# EasyEDA Pro project ProPrj_stm32线束检测系统_2025-05-23.epro, schematic Schematic1_1
Board Name: Board1_1; Create Date: 2025-05-20; Page Name: P1; Project Name: stm32线束检测系统; Schematic Name: Schematic1_1; Update Date: 2025-05-23; Company: 嘉立创EDA; Page Size: A4; Version: V1.0
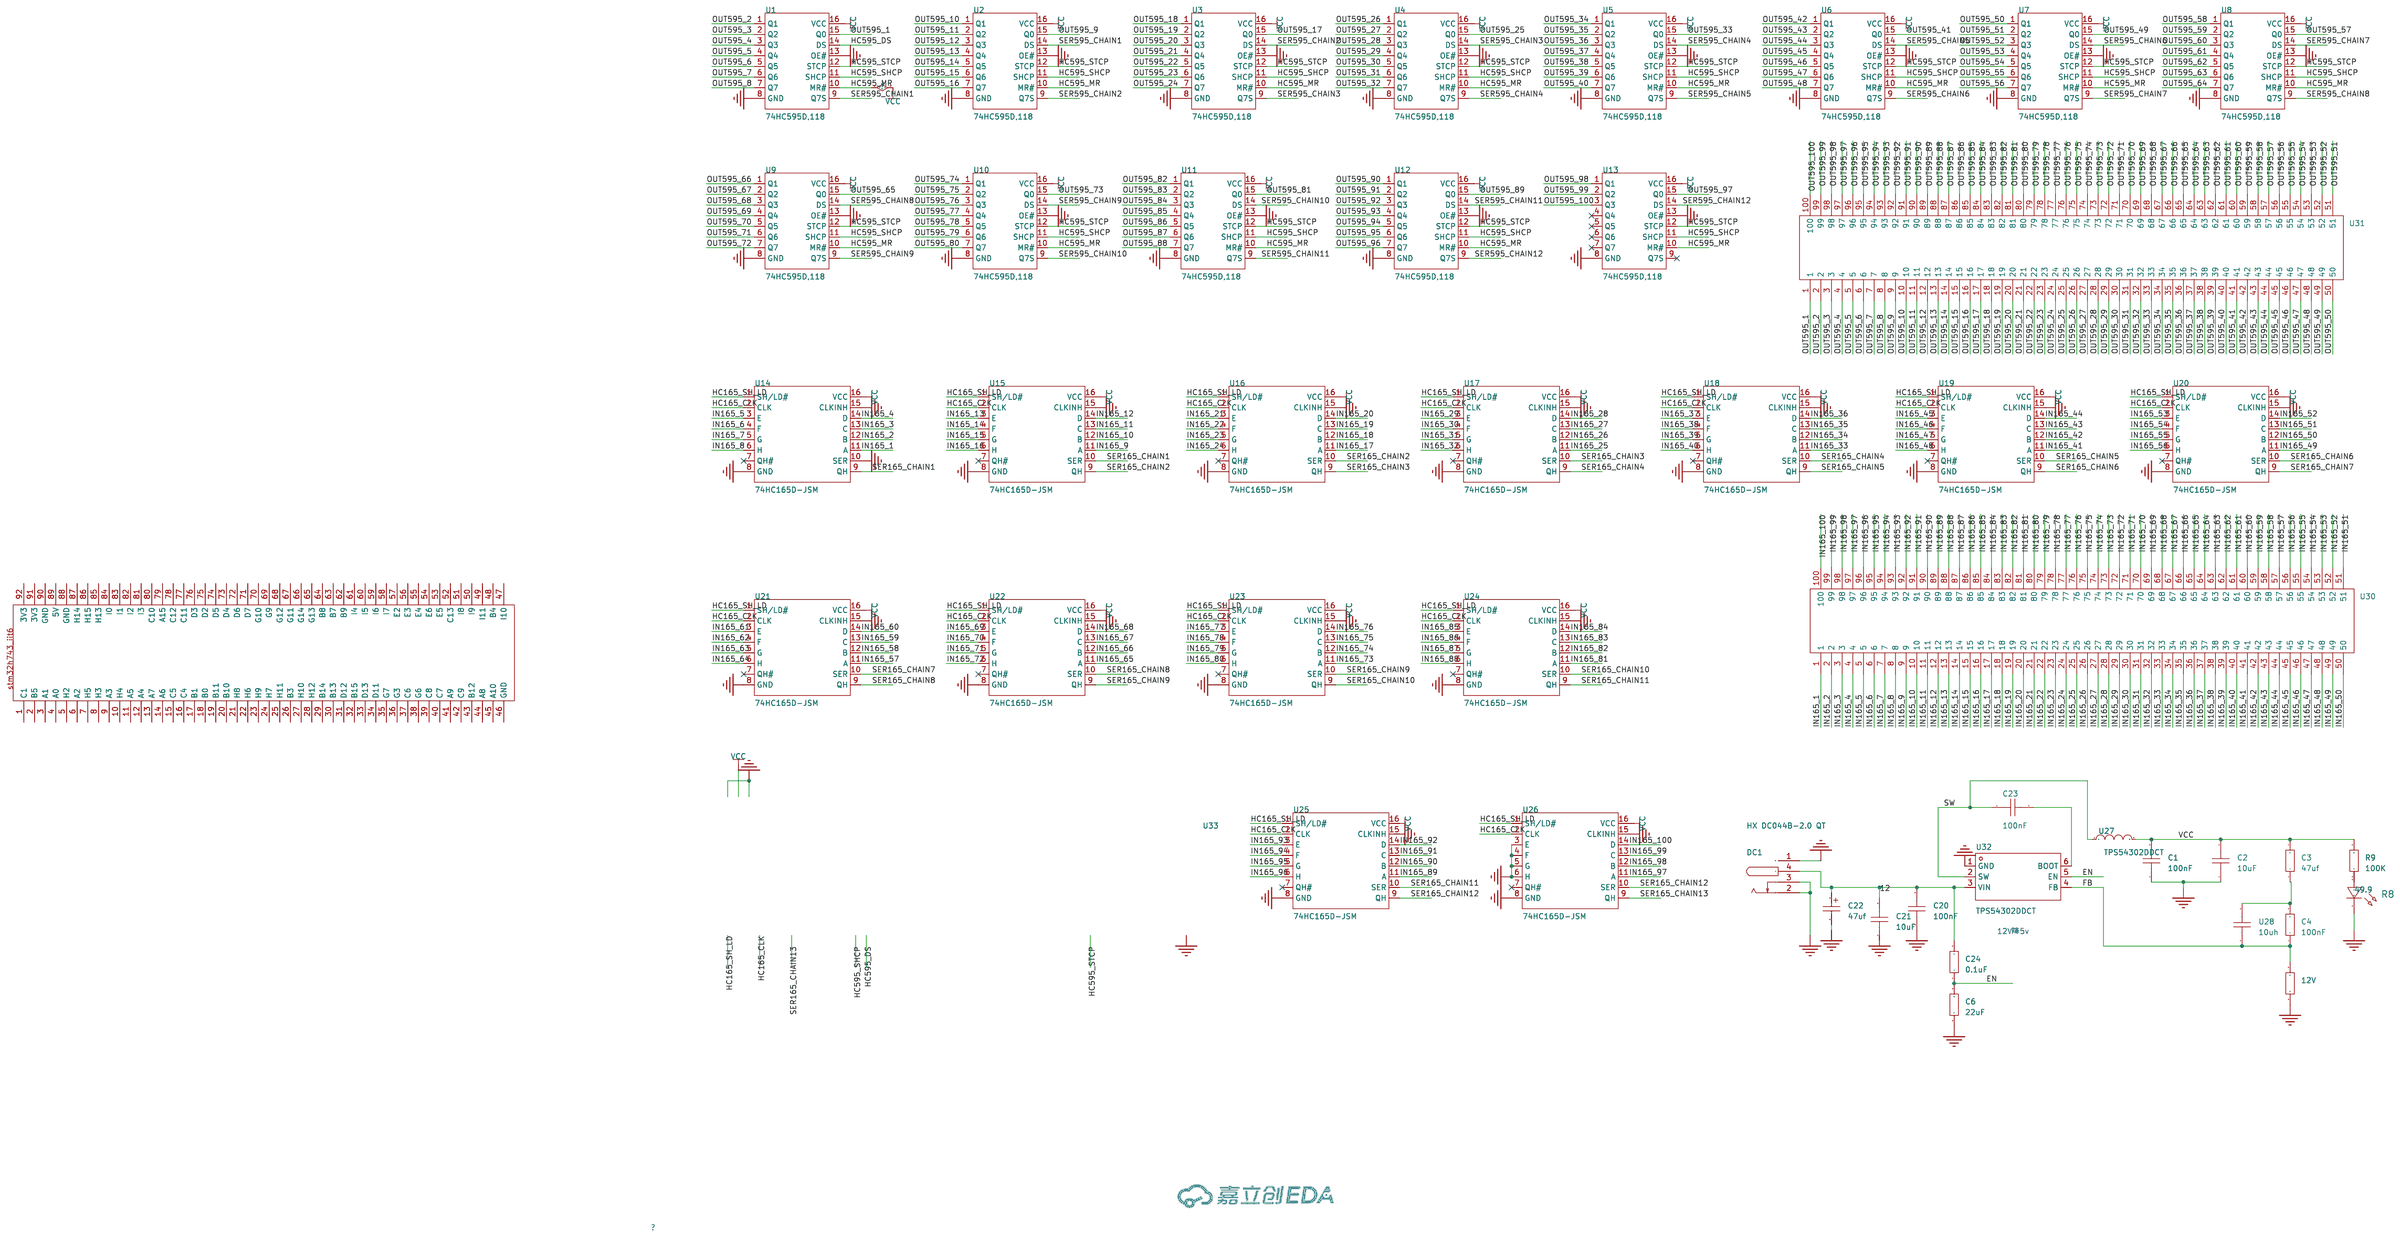
[diagram p0: schematic sheet]

## Parts
12V  HX DC044B-2.0 QT  [DC-IN-TH_HX-DC044B-2.0-QT]
C1  100nF  [C0805]
C2  10uF  [C0805]
C3  47uf  [C_Ele_SMD_5x5.4mm]
C4  100nF  [C0805]
C6  22uF  [C0603]
C20  100nF  [C0805]
C21  10uF  [C0805]
C22  47uf  [C_Ele_SMD_5x5.4mm]
C23  100nF  [C0805]
C24  0.1uF  [C0603]
DC1  HX DC044B-2.0 QT  [DC-IN-TH_HX-DC044B-2.0-QT]
R8  49.9  [R0805]
R9  100K  [R0805]
U1  74HC595D,118  [SOIC-16_L9.9-W3.9-P1.27-LS6.0-BL]
U2  74HC595D,118  [SOIC-16_L9.9-W3.9-P1.27-LS6.0-BL]
U3  74HC595D,118  [SOIC-16_L9.9-W3.9-P1.27-LS6.0-BL]
U4  74HC595D,118  [SOIC-16_L9.9-W3.9-P1.27-LS6.0-BL]
U5  74HC595D,118  [SOIC-16_L9.9-W3.9-P1.27-LS6.0-BL]
U6  74HC595D,118  [SOIC-16_L9.9-W3.9-P1.27-LS6.0-BL]
U7  74HC595D,118  [SOIC-16_L9.9-W3.9-P1.27-LS6.0-BL]
U8  74HC595D,118  [SOIC-16_L9.9-W3.9-P1.27-LS6.0-BL]
U9  74HC595D,118  [SOIC-16_L9.9-W3.9-P1.27-LS6.0-BL]
U10  74HC595D,118  [SOIC-16_L9.9-W3.9-P1.27-LS6.0-BL]
U11  74HC595D,118  [SOIC-16_L9.9-W3.9-P1.27-LS6.0-BL]
U12  74HC595D,118  [SOIC-16_L9.9-W3.9-P1.27-LS6.0-BL]
U13  74HC595D,118  [SOIC-16_L9.9-W3.9-P1.27-LS6.0-BL]
U14  74HC165D-JSM  [SOP-16_L10.0-W3.9-P1.27-LS6.0-BL]
U15  74HC165D-JSM  [SOP-16_L10.0-W3.9-P1.27-LS6.0-BL]
U16  74HC165D-JSM  [SOP-16_L10.0-W3.9-P1.27-LS6.0-BL]
U17  74HC165D-JSM  [SOP-16_L10.0-W3.9-P1.27-LS6.0-BL]
U18  74HC165D-JSM  [SOP-16_L10.0-W3.9-P1.27-LS6.0-BL]
U19  74HC165D-JSM  [SOP-16_L10.0-W3.9-P1.27-LS6.0-BL]
U20  74HC165D-JSM  [SOP-16_L10.0-W3.9-P1.27-LS6.0-BL]
U21  74HC165D-JSM  [SOP-16_L10.0-W3.9-P1.27-LS6.0-BL]
U22  74HC165D-JSM  [SOP-16_L10.0-W3.9-P1.27-LS6.0-BL]
U23  74HC165D-JSM  [SOP-16_L10.0-W3.9-P1.27-LS6.0-BL]
U24  74HC165D-JSM  [SOP-16_L10.0-W3.9-P1.27-LS6.0-BL]
U25  74HC165D-JSM  [SOP-16_L10.0-W3.9-P1.27-LS6.0-BL]
U26  74HC165D-JSM  [SOP-16_L10.0-W3.9-P1.27-LS6.0-BL]
U27  TPS54302DDCT  [TSOT-23-6_L2.9-W1.6-P0.95-LS2.8-BR]
U28  10uh  [IND-SMD_L4.5-W4.0_SCD0403T]
U30  -  [2x50_P2.54_TH]
U31  -  [2x50_P2.54_TH]
U32  TPS54302DDCT  [TSOT-23-6_L2.9-W1.6-P0.95-LS2.8-BR]
U33  -  [stm32h743]

## Library data of the parts
12V DC1 = HX DC044B-2.0 QT: 连接器类型:DC电源插座;安装方式:弯插;触点内径:2mm;触点外径:5.8mm;额定电压:30V;触头材质:-;触头镀层:-;工作温度范围:-;焊接温度(最大值):-;; LCSC Part Name: DC电源插座 内径:2mm 外径:5.8mm; Supplier Part: C41375962; Manufacturer: hanxia(韩下); Supplier Footprint: 插件; Datasheet: https://atta.szlcsc.com/upload/public/pdf/source/20240830/7C11609858F94C5A32999C6C6EF5F6BF.pdf; Supplier: LCSC; Connector Type: DC电源插座; Mounting Style: 弯插; Inside Contact Diameter: 2mm; Outside Contact Diameter: 5.8mm; Voltage Rating (Max): 30V
C1 C2 C20 C21 = CAP_0805: Supplier Footprint: 0805
C3 C22 = C_Ele_SMD_5x5.4mm: Supplier Footprint: SMD,5x5.4mm
C4 C23 = CAP_0805: Supplier Footprint: 0603
C6 C24 = CAP_0603: Supplier Footprint: 0603
R8 R9 = Res_0805: Supplier Footprint: 0603
U1-U13 = 74HC595D,118: 功能:串行至串行或并行;电源电压:2V~6V;元件数:1;每个元件位数:8;; LCSC Part Name: 三态输出 串行至串行或并行移位寄存器; Supplier Part: C5947; Manufacturer: Nexperia(安世); Supplier Footprint: SOIC-16; JLCPCB Part Class: 基础库; Datasheet: https://atta.szlcsc.com/upload/public/pdf/source/20240724/C3A3241CA190230F407C83CEC4244600.pdf; Supplier: LCSC; Function: 串行至串行或并行; Supply Voltage: 2V~6V; Number of Elements: 1; Number of Bits per Element: 8; Output Type: 三态; Series: 74HC; Operating Temperature: -40℃~+125℃
U14-U26 = 74HC165D-JSM: 功能:-;工作电压:2V~6V;时钟频率(fc):-;元件数:1;每个元件位数:8;; Supplier Part: C22447130; Manufacturer: JSMSEMI(杰盛微); Supplier Footprint: SOP-16; JLCPCB Part Class: 扩展库; Datasheet: https://atta.szlcsc.com/upload/public/pdf/source/20240716/3BCDED5764C4B39E28DFA970EEB44471.pdf; Supplier: LCSC; Voltage - Supply: 2V~6V; Number of Elements: 1; Number of Bits per Element: 8; Series: 74HC; Operating Temperature: -40℃~+125℃
U27 U32 = TPS54302DDCT: 功能类型:降压型;输出类型:可调;工作电压:4.5V~28V;输出电压:596mV~28V;输出电流:3A;; LCSC Part Name: 4.5V至28V输入,3A输出,低EMI同步降压转换器; Supplier Part: C129370; Manufacturer: TI(德州仪器); Supplier Footprint: TSOT-23-6; JLCPCB Part Class: 扩展库; Datasheet: https://www.ti.com/cn/lit/gpn/tps54302; Supplier: LCSC; Function: 降压型; Output Type: 可调; Input Voltage: 4.5V~28V; Output Voltage: 596mV~28V; Output Current: 3A; Switching Frequency: 400kHz; Operating Temperature: -40℃~+125℃@(TJ); Synchronous Rectification: 是; Number of Outputs: 1; Topology: 降压式; Switch tube (built-in/external): 内置
U28 = L-03/CD43_C9900011087: LCSC Part Name: L-03/CD43; Supplier Part: C9900011087; Supplier Footprint: 10uH; JLCPCB Part Class: 扩展库; Supplier: LCSC
U30 U31 = 2x50_P2.54_TH
U33 = stm32h743

## Nets
GND: 12V.1 C1.1 C2.1 C6.1 C20.1 C21.1 C22.2 DC1.1(SHELL) DC1.2 DC1.3 R8.1(C) U1.8(GND) U1.13(OE#) U2.8(GND) U2.13(OE#) U3.8(GND) U3.13(OE#) U4.8(GND) U4.13(OE#) U5.8(GND) U5.13(OE#) U6.8(GND) U6.13(OE#) U7.8(GND) U7.13(OE#) U8.8(GND) U8.13(OE#) U9.8(GND) U9.13(OE#) U10.8(GND) U10.13(OE#) U11.8(GND) U11.13(OE#) U12.8(GND) U12.13(OE#) U13.8(GND) U13.13(OE#) U14.8(GND) U14.10(SER) U14.15(CLKINH) U15.8(GND) U15.15(CLKINH) U16.8(GND) U16.15(CLKINH) U17.8(GND) U17.15(CLKINH) U18.8(GND) U18.15(CLKINH) U19.8(GND) U19.15(CLKINH) U20.8(GND) U20.15(CLKINH) U21.8(GND) U21.15(CLKINH) U22.8(GND) U22.15(CLKINH) U23.8(GND) U23.15(CLKINH) U24.8(GND) U24.15(CLKINH) U25.8(GND) U25.15(CLKINH) U26.3(E) U26.4(F) U26.5(G) U26.6(H) U26.8(GND) U26.15(CLKINH) U32.1(GND)
VCC: C1.2 C2.2 C3.2 R9.2 U1.10(MR#) U1.16(VCC) U2.10(MR#) U2.16(VCC) U3.10(MR#) U3.16(VCC) U4.10(MR#) U4.16(VCC) U5.10(MR#) U5.16(VCC) U6.10(MR#) U6.16(VCC) U7.10(MR#) U7.16(VCC) U8.10(MR#) U8.16(VCC) U9.10(MR#) U9.16(VCC) U10.10(MR#) U10.16(VCC) U11.10(MR#) U11.16(VCC) U12.10(MR#) U12.16(VCC) U13.10(MR#) U13.16(VCC) U14.16(VCC) U15.16(VCC) U16.16(VCC) U17.16(VCC) U18.16(VCC) U19.16(VCC) U20.16(VCC) U21.16(VCC) U22.16(VCC) U23.16(VCC) U24.16(VCC) U25.16(VCC) U26.16(VCC) U27.2
12: C20.2 C21.2 C22.1 C24.2 DC1.4 U32.3(VIN)
EN: C6.2 C24.1 U32.5(EN)
FB: 12V.2 C4.1 U28.1 U32.4(FB)
HC165_CLK: U14.2(CLK) U15.2(CLK) U16.2(CLK) U17.2(CLK) U18.2(CLK) U19.2(CLK) U20.2(CLK) U21.2(CLK) U22.2(CLK) U23.2(CLK) U24.2(CLK) U25.2(CLK) U26.2(CLK)
HC165_SH_LD: U14.1(SH/LD#) U15.1(SH/LD#) U16.1(SH/LD#) U17.1(SH/LD#) U18.1(SH/LD#) U19.1(SH/LD#) U20.1(SH/LD#) U21.1(SH/LD#) U22.1(SH/LD#) U23.1(SH/LD#) U24.1(SH/LD#) U25.1(SH/LD#) U26.1(SH/LD#)
HC595_DS: U1.14(DS)
HC595_SHCP: U1.11(SHCP) U2.11(SHCP) U3.11(SHCP) U4.11(SHCP) U5.11(SHCP) U6.11(SHCP) U7.11(SHCP) U8.11(SHCP) U9.11(SHCP) U10.11(SHCP) U11.11(SHCP) U12.11(SHCP) U13.11(SHCP)
HC595_STCP: U1.12(STCP) U2.12(STCP) U3.12(STCP) U4.12(STCP) U5.12(STCP) U6.12(STCP) U7.12(STCP) U8.12(STCP) U9.12(STCP) U10.12(STCP) U11.12(STCP) U12.12(STCP) U13.12(STCP)
IN165_1: U14.11(A) U30.1
IN165_2: U14.12(B) U30.2
IN165_3: U14.13(C) U30.3
IN165_4: U14.14(D) U30.4
IN165_5: U14.3(E) U30.5
IN165_6: U14.4(F) U30.6
IN165_7: U14.5(G) U30.7
IN165_8: U14.6(H) U30.8
IN165_9: U15.11(A) U30.9
IN165_10: U15.12(B) U30.10
IN165_11: U15.13(C) U30.11
IN165_12: U15.14(D) U30.12
IN165_13: U15.3(E) U30.13
IN165_14: U15.4(F) U30.14
IN165_15: U15.5(G) U30.15
IN165_16: U15.6(H) U30.16
IN165_17: U16.11(A) U30.17
IN165_18: U16.12(B) U30.18
IN165_19: U16.13(C) U30.19
IN165_20: U16.14(D) U30.20
IN165_21: U16.3(E) U30.21
IN165_22: U16.4(F) U30.22
IN165_23: U16.5(G) U30.23
IN165_24: U16.6(H) U30.24
IN165_25: U17.11(A) U30.25
IN165_26: U17.12(B) U30.26
IN165_27: U17.13(C) U30.27
IN165_28: U17.14(D) U30.28
IN165_29: U17.3(E) U30.29
IN165_30: U17.4(F) U30.30
IN165_31: U17.5(G) U30.31
IN165_32: U17.6(H) U30.32
IN165_33: U18.11(A) U30.33
IN165_34: U18.12(B) U30.34
IN165_35: U18.13(C) U30.35
IN165_36: U18.14(D) U30.36
IN165_37: U18.3(E) U30.37
IN165_38: U18.4(F) U30.38
IN165_39: U18.5(G) U30.39
IN165_40: U18.6(H) U30.40
IN165_41: U19.11(A) U30.41
IN165_42: U19.12(B) U30.42
IN165_43: U19.13(C) U30.43
IN165_44: U19.14(D) U30.44
IN165_45: U19.3(E) U30.45
IN165_46: U19.4(F) U30.46
IN165_47: U19.5(G) U30.47
IN165_48: U19.6(H) U30.48
IN165_49: U20.11(A) U30.49
IN165_50: U20.12(B) U30.50
IN165_51: U20.13(C) U30.51
IN165_52: U20.14(D) U30.52
IN165_53: U20.3(E) U30.53
IN165_54: U20.4(F) U30.54
IN165_55: U20.5(G) U30.55
IN165_56: U20.6(H) U30.56
IN165_57: U21.11(A) U30.57
IN165_58: U21.12(B) U30.58
IN165_59: U21.13(C) U30.59
IN165_60: U21.14(D) U30.60
IN165_61: U21.3(E) U30.61
IN165_62: U21.4(F) U30.62
IN165_63: U21.5(G) U30.63
IN165_64: U21.6(H) U30.64
IN165_65: U22.11(A) U30.65
IN165_66: U22.12(B) U30.66
IN165_67: U22.13(C) U30.67
IN165_68: U22.14(D) U30.68
IN165_69: U22.3(E) U30.69
IN165_70: U22.4(F) U30.70
IN165_71: U22.5(G) U30.71
IN165_72: U22.6(H) U30.72
IN165_73: U23.11(A) U30.73
IN165_74: U23.12(B) U30.74
IN165_75: U23.13(C) U30.75
IN165_76: U23.14(D) U30.76
IN165_77: U23.3(E) U30.77
IN165_78: U23.4(F) U30.78
IN165_79: U23.5(G) U30.79
IN165_80: U23.6(H) U30.80
IN165_81: U24.11(A) U30.81
IN165_82: U24.12(B) U30.82
IN165_83: U24.13(C) U30.83
IN165_84: U24.14(D) U30.84
IN165_85: U24.3(E) U30.85
IN165_86: U24.4(F) U30.86
IN165_87: U24.5(G) U30.87
IN165_88: U24.6(H) U30.88
IN165_89: U25.11(A) U30.89
IN165_90: U25.12(B) U30.90
IN165_91: U25.13(C) U30.91
IN165_92: U25.14(D) U30.92
IN165_93: U25.3(E) U30.93
IN165_94: U25.4(F) U30.94
IN165_95: U25.5(G) U30.95
IN165_96: U25.6(H) U30.96
IN165_97: U26.11(A) U30.97
IN165_98: U26.12(B) U30.98
IN165_99: U26.13(C) U30.99
IN165_100: U26.14(D) U30.100
OUT595_1: U1.15(Q0) U31.1
OUT595_2: U1.1(Q1) U31.2
OUT595_3: U1.2(Q2) U31.3
OUT595_4: U1.3(Q3) U31.4
OUT595_5: U1.4(Q4) U31.5
OUT595_6: U1.5(Q5) U31.6
OUT595_7: U1.6(Q6) U31.7
OUT595_8: U1.7(Q7) U31.8
OUT595_9: U2.15(Q0) U31.9
OUT595_10: U2.1(Q1) U31.10
OUT595_11: U2.2(Q2) U31.11
OUT595_12: U2.3(Q3) U31.12
OUT595_13: U2.4(Q4) U31.13
OUT595_14: U2.5(Q5) U31.14
OUT595_15: U2.6(Q6) U31.15
OUT595_16: U2.7(Q7) U31.16
OUT595_17: U3.15(Q0) U31.17
OUT595_18: U3.1(Q1) U31.18
OUT595_19: U3.2(Q2) U31.19
OUT595_20: U3.3(Q3) U31.20
OUT595_21: U3.4(Q4) U31.21
OUT595_22: U3.5(Q5) U31.22
OUT595_23: U3.6(Q6) U31.23
OUT595_24: U3.7(Q7) U31.24
OUT595_25: U4.15(Q0) U31.25
OUT595_26: U4.1(Q1) U31.26
OUT595_27: U4.2(Q2) U31.27
OUT595_28: U4.3(Q3) U31.28
OUT595_29: U4.4(Q4) U31.29
OUT595_30: U4.5(Q5) U31.30
OUT595_31: U4.6(Q6) U31.31
OUT595_32: U4.7(Q7) U31.32
OUT595_33: U5.15(Q0) U31.33
OUT595_34: U5.1(Q1) U31.34
OUT595_35: U5.2(Q2) U31.35
OUT595_36: U5.3(Q3) U31.36
OUT595_37: U5.4(Q4) U31.37
OUT595_38: U5.5(Q5) U31.38
OUT595_39: U5.6(Q6) U31.39
OUT595_40: U5.7(Q7) U31.40
OUT595_41: U6.15(Q0) U31.41
OUT595_42: U6.1(Q1) U31.42
OUT595_43: U6.2(Q2) U31.43
OUT595_44: U6.3(Q3) U31.44
OUT595_45: U6.4(Q4) U31.45
OUT595_46: U6.5(Q5) U31.46
OUT595_47: U6.6(Q6) U31.47
OUT595_48: U6.7(Q7) U31.48
OUT595_49: U7.15(Q0) U31.49
OUT595_50: U7.1(Q1) U31.50
OUT595_51: U7.2(Q2) U31.51
OUT595_52: U7.3(Q3) U31.52
OUT595_53: U7.4(Q4) U31.53
OUT595_54: U7.5(Q5) U31.54
OUT595_55: U7.6(Q6) U31.55
OUT595_56: U7.7(Q7) U31.56
OUT595_57: U8.15(Q0) U31.57
OUT595_58: U8.1(Q1) U31.58
OUT595_59: U8.2(Q2) U31.59
OUT595_60: U8.3(Q3) U31.60
OUT595_61: U8.4(Q4) U31.61
OUT595_62: U8.5(Q5) U31.62
OUT595_63: U8.6(Q6) U31.63
OUT595_64: U8.7(Q7) U31.64
OUT595_65: U9.15(Q0) U31.65
OUT595_66: U9.1(Q1) U31.66
OUT595_67: U9.2(Q2) U31.67
OUT595_68: U9.3(Q3) U31.68
OUT595_69: U9.4(Q4) U31.69
OUT595_70: U9.5(Q5) U31.70
OUT595_71: U9.6(Q6) U31.71
OUT595_72: U9.7(Q7) U31.72
OUT595_73: U10.15(Q0) U31.73
OUT595_74: U10.1(Q1) U31.74
OUT595_75: U10.2(Q2) U31.75
OUT595_76: U10.3(Q3) U31.76
OUT595_77: U10.4(Q4) U31.77
OUT595_78: U10.5(Q5) U31.78
OUT595_79: U10.6(Q6) U31.79
OUT595_80: U10.7(Q7) U31.80
OUT595_81: U11.15(Q0) U31.81
OUT595_82: U11.1(Q1) U31.82
OUT595_83: U11.2(Q2) U31.83
OUT595_84: U11.3(Q3) U31.84
OUT595_85: U11.4(Q4) U31.85
OUT595_86: U11.5(Q5) U31.86
OUT595_87: U11.6(Q6) U31.87
OUT595_88: U11.7(Q7) U31.88
OUT595_89: U12.15(Q0) U31.89
OUT595_90: U12.1(Q1) U31.90
OUT595_91: U12.2(Q2) U31.91
OUT595_92: U12.3(Q3) U31.92
OUT595_93: U12.4(Q4) U31.93
OUT595_94: U12.5(Q5) U31.94
OUT595_95: U12.6(Q6) U31.95
OUT595_96: U12.7(Q7) U31.96
OUT595_97: U13.15(Q0) U31.97
OUT595_98: U13.1(Q1) U31.98
OUT595_99: U13.2(Q2) U31.99
OUT595_100: U13.3(Q3) U31.100
SER165_CHAIN1: U14.9(QH) U15.10(SER)
SER165_CHAIN2: U15.9(QH) U16.10(SER)
SER165_CHAIN3: U16.9(QH) U17.10(SER)
SER165_CHAIN4: U17.9(QH) U18.10(SER)
SER165_CHAIN5: U18.9(QH) U19.10(SER)
SER165_CHAIN6: U19.9(QH) U20.10(SER)
SER165_CHAIN7: U20.9(QH) U21.10(SER)
SER165_CHAIN8: U21.9(QH) U22.10(SER)
SER165_CHAIN9: U22.9(QH) U23.10(SER)
SER165_CHAIN10: U23.9(QH) U24.10(SER)
SER165_CHAIN11: U24.9(QH) U25.10(SER)
SER165_CHAIN12: U25.9(QH) U26.10(SER)
SER165_CHAIN13: U26.9(QH)
SER595_CHAIN1: U1.9(Q7S) U2.14(DS)
SER595_CHAIN2: U2.9(Q7S) U3.14(DS)
SER595_CHAIN3: U3.9(Q7S) U4.14(DS)
SER595_CHAIN4: U4.9(Q7S) U5.14(DS)
SER595_CHAIN5: U5.9(Q7S) U6.14(DS)
SER595_CHAIN6: U6.9(Q7S) U7.14(DS)
SER595_CHAIN7: U7.9(Q7S) U8.14(DS)
SER595_CHAIN8: U8.9(Q7S) U9.14(DS)
SER595_CHAIN9: U9.9(Q7S) U10.14(DS)
SER595_CHAIN10: U10.9(Q7S) U11.14(DS)
SER595_CHAIN11: U11.9(Q7S) U12.14(DS)
SER595_CHAIN12: U12.9(Q7S) U13.14(DS)
SW: C23.1 U27.1 U32.2(SW)
Net-(C3-1): C3.1 C4.2 U28.2
Net-(C23-2): C23.2 U32.6(BOOT)
Net-(R8-2): R8.2(A) R9.1

Not connected (* = marked no-connect by the designer): U13 4(Q4)* 5(Q5)* 6(Q6)* 7(Q7)* 9(Q7S)*; U14 7(QH#)*; U15 7(QH#)*; U16 7(QH#)*; U17 7(QH#)*; U18 7(QH#)*; U19 7(QH#)*; U20 7(QH#)*; U21 7(QH#)*; U22 7(QH#)*; U23 7(QH#)*; U24 7(QH#)*; U25 7(QH#)*; U26 7(QH#)*; U33 1(C1) 2(B5) 3(A1) 4(A0) 5(H2) 6(A2) 7(H5) 8(H3) 9(A3) 10(H4) 11(A5) 12(A4) 13(A7) 14(A6) 15(C5) 16(C4) 17(B1) 18(B0) 19(B11) 20(B10) 21(H8) 22(H6) 23(H9) 24(H7) 25(H11) 26(B3) 27(H10) 28(H12) 29(B14) 30(B13) 31(D12) 32(B15) 33(D13) 34(D11) 35(G7) 36(G3) 37(C6) 38(G6) 39(C8) 40(C7) 41(A9) 42(C9) 43(B12) 44(A8) 45(A10) 46(GND) 47(I10) 48(B4) 49(I11) 50(I9) 51(I8) 52(C13) 53(E5) 54(E6) 55(E4) 56(E3) 57(E2) 58(I7) 59(I6) 60(I5) 61(I4) 62(B9) 63(B7) 64(B8) 65(G13) 66(G14) 67(G11) 68(G12) 69(G9) 70(G10) 71(D7) 72(D6) 73(D4) 74(D5) 75(D2) 76(D3) 77(C11) 78(C12) 79(A15) 80(C10) 81(I3) 82(I2) 83(I1) 84(I0) 85(H13) 86(H15) 87(H14) 88(GND) 89(5V) 90(GND) 91(3V3) 92(3V3)

## Notes on the sheet
- 12V降5v
